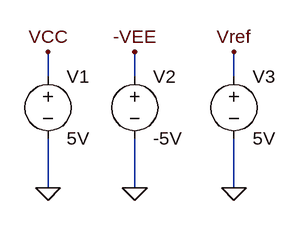
[diagram p0: schematic Integrator AO + Trigger-Schmidt.asc]
Integrator AO + Trigger-Schmidt.asc, the LTspice schematic file:
Version 4.1
SHEET 1 1960 680
WIRE -80 64 -80 32
WIRE 32 64 32 32
WIRE 160 64 160 32
WIRE -80 208 -80 144
WIRE 32 208 32 144
WIRE 160 208 160 144
FLAG -80 208 0
FLAG 32 208 0
FLAG 160 208 0
FLAG -80 32 VCC
FLAG 32 32 -VEE
FLAG 160 32 Vref
SYMBOL voltage -80 48 R0
SYMATTR InstName V1
SYMATTR Value 5V
SYMBOL voltage 32 48 R0
SYMATTR InstName V2
SYMATTR Value -5V
SYMBOL voltage 160 48 R0
SYMATTR InstName V3
SYMATTR Value 5V

The netlist it stands for:
* Integrator AO + Trigger-Schmidt.asc
V1 VCC 0 5V
V2 -VEE 0 -5V
V3 Vref 0 5V
.backanno
.end